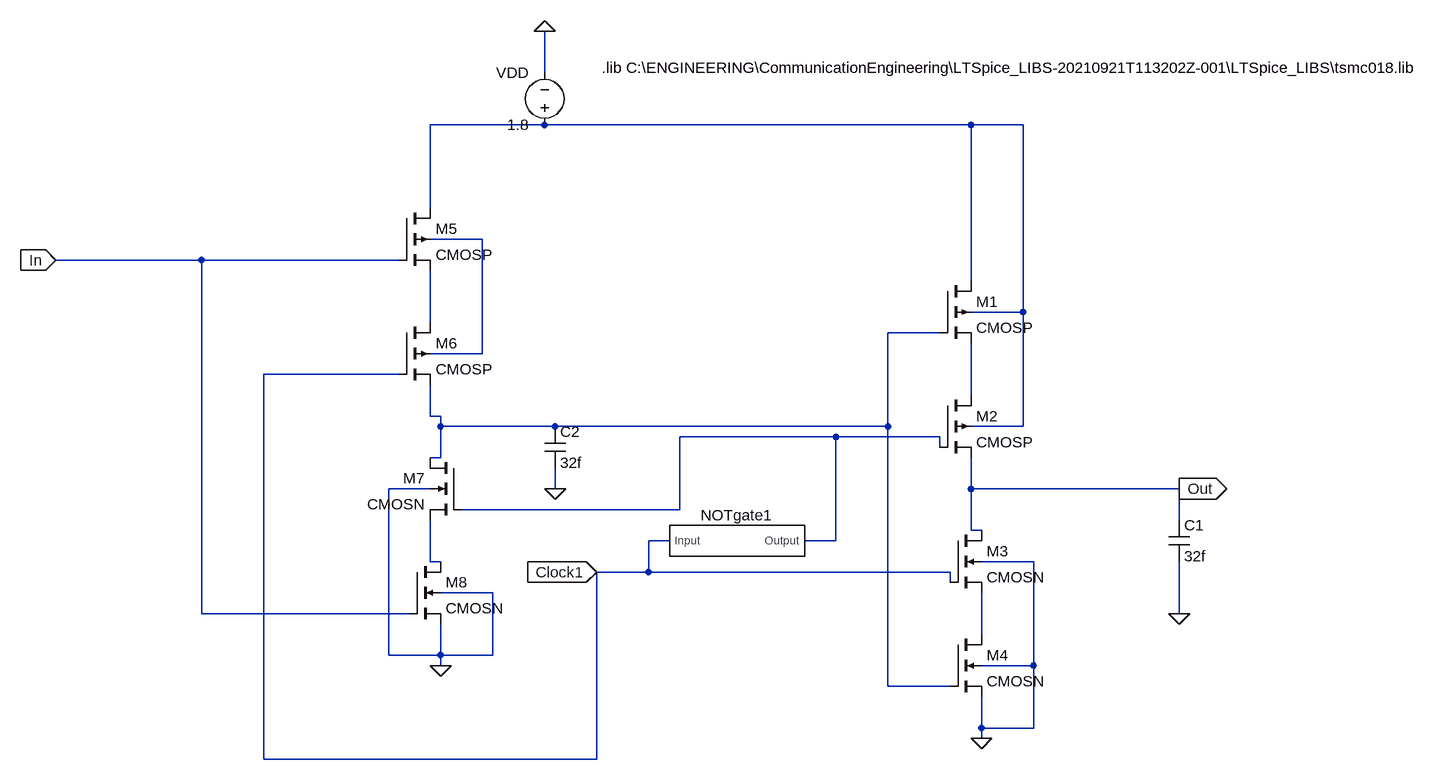
[diagram p0: schematic D_Flip_Flop_M_S1.asc]
D_Flip_Flop_M_S1.asc, the LTspice schematic file:
Version 4
SHEET 1 1376 1044
WIRE -160 -16 -160 -80
WIRE -160 64 -336 64
WIRE 496 64 -160 64
WIRE 576 64 496 64
WIRE -336 192 -336 64
WIRE -256 240 -336 240
WIRE -688 272 -912 272
WIRE -384 272 -688 272
WIRE 496 304 496 64
WIRE 576 352 576 64
WIRE 576 352 496 352
WIRE -336 368 -336 288
WIRE 448 384 368 384
WIRE -256 416 -256 240
WIRE -256 416 -336 416
WIRE -384 448 -592 448
WIRE 496 480 496 400
WIRE -336 512 -336 464
WIRE -320 512 -336 512
WIRE -320 528 -320 512
WIRE -144 528 -320 528
WIRE 368 528 368 384
WIRE 368 528 -144 528
WIRE 576 528 576 352
WIRE 576 528 496 528
WIRE 288 544 48 544
WIRE 448 544 288 544
WIRE 448 560 448 544
WIRE -320 576 -320 528
WIRE -320 576 -336 576
WIRE -336 624 -400 624
WIRE -144 624 -144 592
WIRE 496 624 496 576
WIRE 816 624 496 624
WIRE 48 656 48 544
WIRE 48 656 -288 656
WIRE 816 672 816 624
WIRE 496 688 496 624
WIRE 512 688 496 688
WIRE 32 704 0 704
WIRE 288 704 288 544
WIRE 288 704 240 704
WIRE -336 736 -336 672
WIRE -320 736 -336 736
WIRE 592 736 512 736
WIRE 0 752 0 704
WIRE 0 752 -80 752
WIRE 464 752 0 752
WIRE 464 768 464 752
WIRE -240 784 -320 784
WIRE -688 816 -688 272
WIRE -368 816 -688 816
WIRE 816 816 816 736
WIRE 512 848 512 784
WIRE -400 880 -400 624
WIRE -320 880 -320 832
WIRE -320 880 -400 880
WIRE -240 880 -240 784
WIRE -240 880 -320 880
WIRE -320 896 -320 880
WIRE 592 896 592 736
WIRE 592 896 512 896
WIRE 368 928 368 528
WIRE 464 928 368 928
WIRE 512 992 512 944
WIRE 592 992 592 896
WIRE 592 992 512 992
WIRE 512 1008 512 992
WIRE -592 1040 -592 448
WIRE -80 1040 -80 752
WIRE -80 1040 -592 1040
FLAG -160 -80 0
FLAG 512 1008 0
FLAG 816 816 0
FLAG -320 896 0
FLAG -144 624 0
FLAG -912 272 In
IOPIN -912 272 In
FLAG 816 624 Out
IOPIN 816 624 Out
FLAG -80 752 Clock1
IOPIN -80 752 In
SYMBOL pmos4 448 304 R0
SYMATTR InstName M1
SYMATTR Value CMOSP
SYMATTR Value2 l=180n w=660n
SYMBOL pmos4 448 480 R0
SYMATTR InstName M2
SYMATTR Value CMOSP
SYMATTR Value2 l=180n w=660n
SYMBOL nmos4 464 688 R0
SYMATTR InstName M3
SYMATTR Value CMOSN
SYMATTR Value2 l=180n w=220n
SYMBOL nmos4 464 848 R0
SYMATTR InstName M4
SYMATTR Value CMOSN
SYMATTR Value2 l=180n w=220n
SYMBOL voltage -160 80 R180
WINDOW 0 24 96 Left 2
WINDOW 3 24 16 Left 2
SYMATTR InstName VDD
SYMATTR Value 1.8
SYMBOL cap 800 672 R0
SYMATTR InstName C1
SYMATTR Value 32f
SYMBOL pmos4 -384 192 R0
SYMATTR InstName M5
SYMATTR Value CMOSP
SYMATTR Value2 l=180n w=660n
SYMBOL pmos4 -384 368 R0
SYMATTR InstName M6
SYMATTR Value CMOSP
SYMATTR Value2 l=180n w=660n
SYMBOL nmos4 -288 576 M0
SYMATTR InstName M7
SYMATTR Value CMOSN
SYMATTR Value2 l=180n w=220n
SYMBOL nmos4 -368 736 R0
SYMATTR InstName M8
SYMATTR Value CMOSN
SYMATTR Value2 l=180n w=220n
SYMBOL cap -160 528 R0
SYMATTR InstName C2
SYMATTR Value 32f
SYMBOL NOT_model1 128 704 R0
SYMATTR InstName NOTgate1
TEXT -72 -24 Left 2 !.lib C:\\ENGINEERING\\CommunicationEngineering\\LTSpice_LIBS-20210921T113202Z-001\\LTSpice_LIBS\\tsmc018.lib

The netlist it stands for:
* D_Flip_Flop_M_S1.asc
M1 N001 N004 N005 N001 CMOSP l=180n w=660n
M2 N005 N006 Out N001 CMOSP l=180n w=660n
M3 Out Clock1 N008 0 CMOSN l=180n w=220n
M4 N008 N004 0 0 CMOSN l=180n w=220n
VDD N001 0 1.8
C1 Out 0 32f
M5 N001 In N003 N002 CMOSP l=180n w=660n
M6 N003 Clock1 N004 N002 CMOSP l=180n w=660n
M7 N004 N006 N007 0 CMOSN l=180n w=220n
M8 N007 In 0 0 CMOSN l=180n w=220n
C2 N004 0 32f
XNOTgate1 Clock1 N006 NOT0  ; pins Input Output
.model NMOS NMOS
.model PMOS PMOS
.lib standard.mos
.lib C:\ENGINEERING\CommunicationEngineering\LTSpice_LIBS-20210921T113202Z-001\LTSpice_LIBS\tsmc018.lib
.backanno
.end